# EAGLE design v11 (EAGLE 7.2.0)
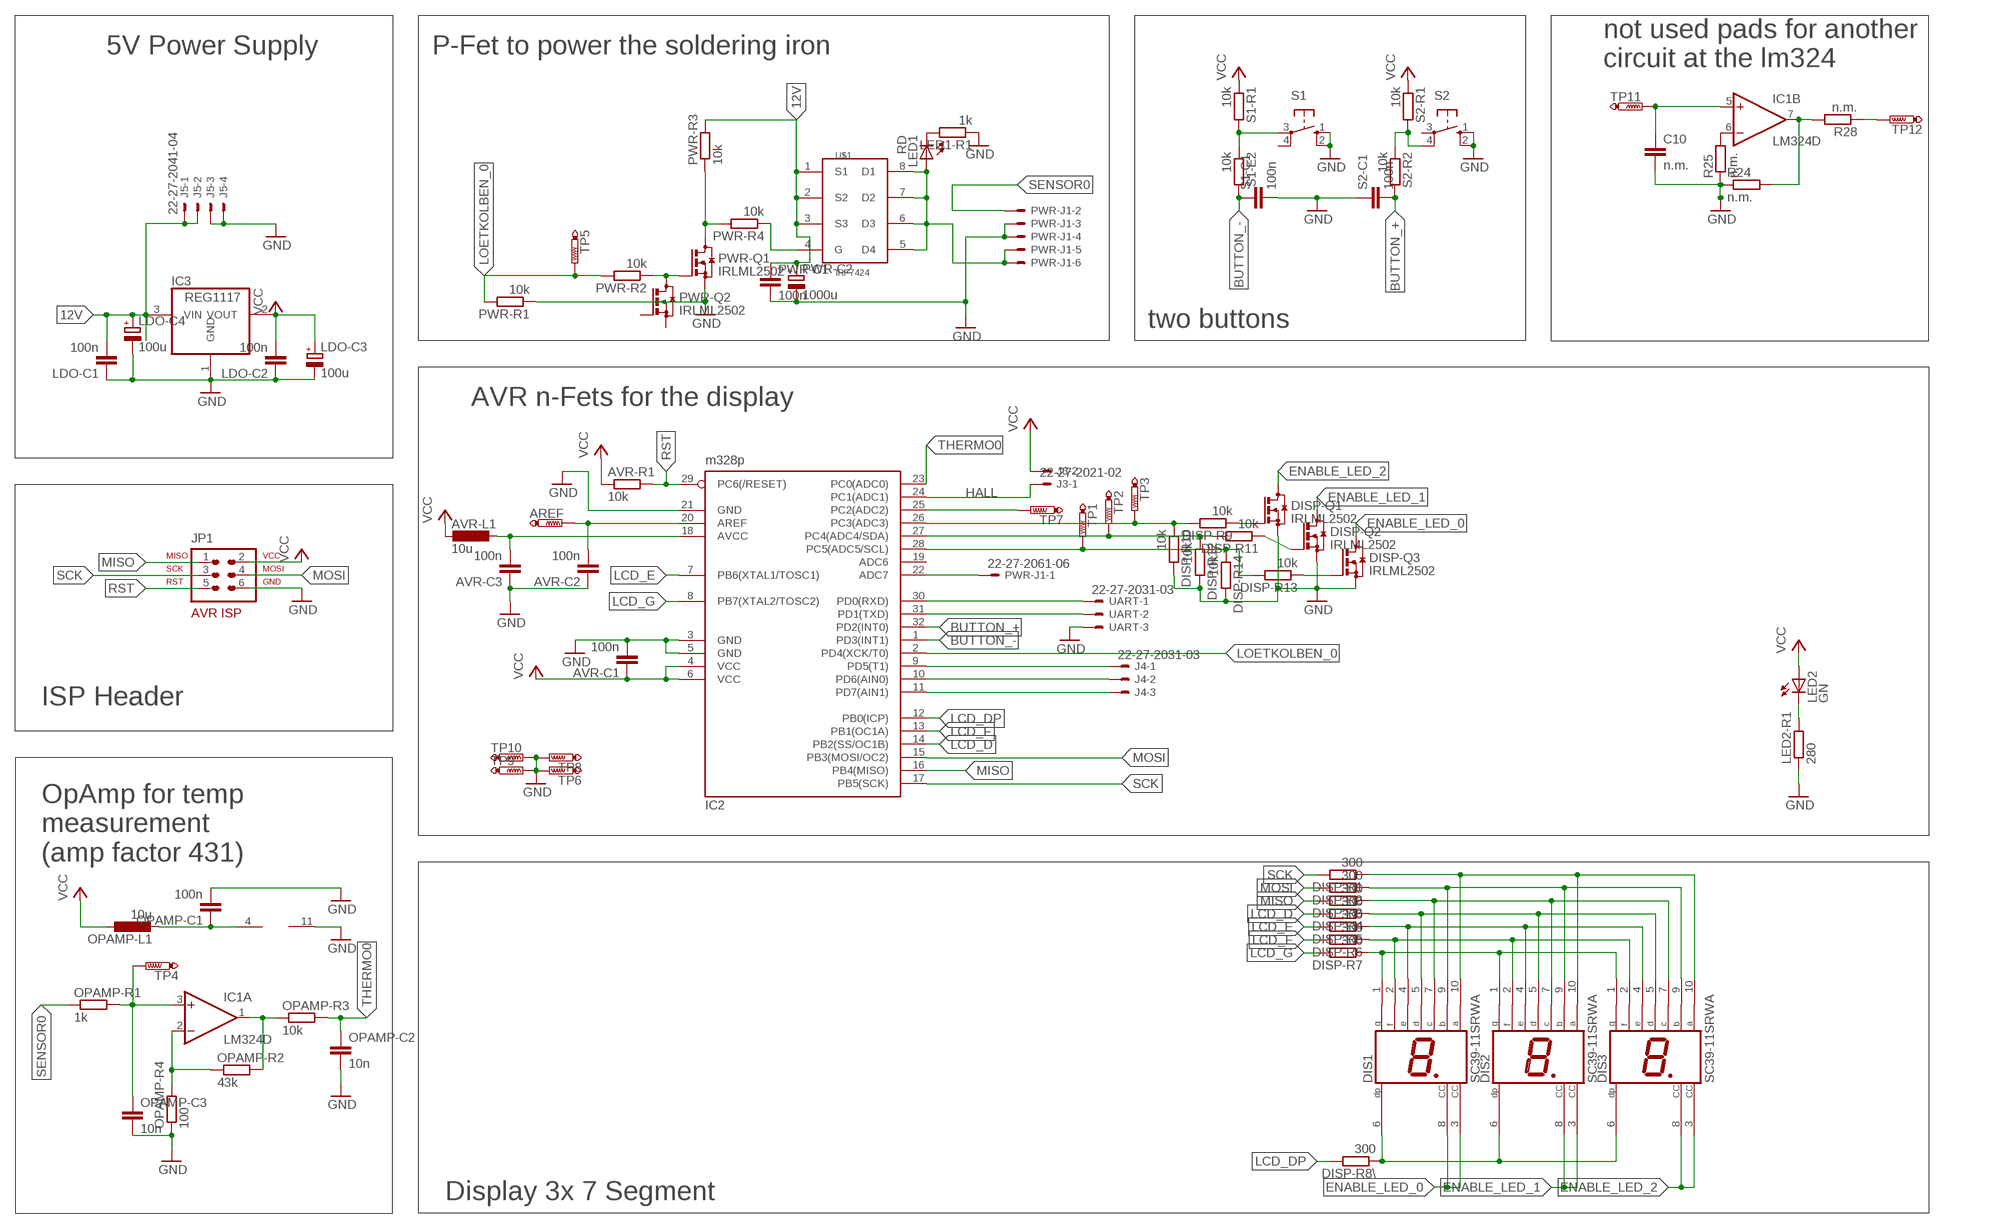
[diagram p0: schematic, sheet 1]

## Parts
AREF  PTR1B1,27  [B1,27]
AVR-C1  100n  C-EUC0603  [C0603]
AVR-C2  100n  C-EUC0603  [C0603]
AVR-C3  100n  C-EUC0603  [C0603]
AVR-L1  10u  L-EUL2825P  [L2825P]
AVR-R1  10k  R-EU_R0603  [R0603]
C10  n.m.  C-EUC0603  [C0603]
DIS1  SC39-11SRWA  [HDSP-E]
DIS2  SC39-11SRWA  [HDSP-E]
DIS3  SC39-11SRWA  [HDSP-E]
DISP-Q1  IRLML2502  BSS123  [SOT23]
DISP-Q2  IRLML2502  BSS123  [SOT23]
DISP-Q3  IRLML2502  BSS123  [SOT23]
DISP-R1  300  R-EU_R0603  [R0603]
DISP-R2  300  R-EU_R0603  [R0603]
DISP-R3  300  R-EU_R0603  [R0603]
DISP-R4  300  R-EU_R0603  [R0603]
DISP-R5  300  R-EU_R0603  [R0603]
DISP-R6  300  R-EU_R0603  [R0603]
DISP-R7  300  R-EU_R0603  [R0603]
DISP-R8\  300  R-EU_R0603  [R0603]
DISP-R9  10k  R-EU_R0603  [R0603]
DISP-R10  10k  R-EU_R0603  [R0603]
DISP-R11  10k  R-EU_R0603  [R0603]
DISP-R12  10k  R-EU_R0603  [R0603]
DISP-R13  10k  R-EU_R0603  [R0603]
DISP-R14  10k  R-EU_R0603  [R0603]
IC1  LM324D  [SO14]
IC2  m328p  MEGA8-AI  [TQFP32-08]
IC3  REG1117  [SOT223]
J3  22-27-2021-02  [6410-02]
J4  22-27-2031-03  [6410-03]
J5  22-27-2041-04  [6410-04]
JP1  AVR-ISP-6VERT  [AVR-ISP-6]
LDO-C1  100n  C-EUC0603  [C0603]
LDO-C2  100n  C-EUC0603  [C0603]
LDO-C3  100u  CPOL-EUE2-5  [E2-5]
LDO-C4  100u  CPOL-EUE2-5  [E2-5]
LED1  RD  LEDCHIP-LED0805  [CHIP-LED0805]
LED1-R1  1k  R-EU_R0603  [R0603]
LED2  GN  LEDCHIP-LED0805  [CHIP-LED0805]
LED2-R1  280  R-EU_R0603  [R0603]
OPAMP-C1  100n  C-EUC0603  [C0603]
OPAMP-C2  10n  C-EUC0603  [C0603]
OPAMP-C3  10n  C-EUC0603  [C0603]
OPAMP-L1  10u  L-EUL2825P  [L2825P]
OPAMP-R1  1k  R-EU_R0603  [R0603]
OPAMP-R2  43k  R-EU_R0603  [R0603]
OPAMP-R3  10k  R-EU_R0603  [R0603]
OPAMP-R4  100  R-EU_R0603  [R0603]
PWR-C1  100n  C-EUC0603  [C0603]
PWR-C2  1000u  CPOL-EUE5-13  [E5-13]
PWR-J1  22-27-2061-06  [6410-06]
PWR-Q1  IRLML2502  BSS123  [SOT23]
PWR-Q2  IRLML2502  BSS123  [SOT23]
PWR-R1  10k  R-EU_R0603  [R0603]
PWR-R2  10k  R-EU_R0603  [R0603]
PWR-R3  10k  R-EU_R0603  [R0603]
PWR-R4  10k  R-EU_R0603  [R0603]
R24  n.m.  R-EU_R0603  [R0603]
R25  n.m.  R-EU_R0603  [R0603]
R28  n.m.  R-EU_R0603  [R0603]
S1  10-XX  [B3F-10XX]
S1-C1  100n  C-EUC0603  [C0603]
S1-E2  10k  R-EU_R0603  [R0603]
S1-R1  10k  R-EU_R0603  [R0603]
S2  10-XX  [B3F-10XX]
S2-C1  100n  C-EUC0603  [C0603]
S2-R1  10k  R-EU_R0603  [R0603]
S2-R2  10k  R-EU_R0603  [R0603]
TP1  PTR1B1,27  [B1,27]
TP2  PTR1B1,27  [B1,27]
TP3  PTR1B1,27  [B1,27]
TP4  PTR1B1,27  [B1,27]
TP5  PTR1B1,27  [B1,27]
TP6  PTR1B1,27  [B1,27]
TP7  PTR1B1,27  [B1,27]
TP8  PTR1B1,27  [B1,27]
TP9  PTR1B1,27  [B1,27]
TP10  PTR1B1,27  [B1,27]
TP11  PTR1B1,27  [B1,27]
TP12  PTR1B1,27  [B1,27]
U$1  IRF7424  [SO-08]
UART  22-27-2031-03  [6410-03]

## Nets
12V: IC3.3(VIN) J5.1 J5.2 LDO-C1.2 LDO-C4.+ PWR-C1.1 PWR-C2.+ PWR-R3.2 U$1.1(S1) U$1.2(S2) U$1.3(S3)
ADC2: IC2.25(PC2(ADC2)) TP7.TP
ADC7: IC2.22(ADC7) PWR-J1.1
AREF: AREF.TP AVR-C2.2 IC2.20(AREF)
BUTTON_+: IC2.32(PD2(INT0)) S2-C1.2 S2-R2.2
BUTTON_-: IC2.1(PD3(INT1)) S1-C1.1 S1-E2.2
ENABLE_LED_0: DIS1.3(CC) DIS1.8(CC) DISP-Q3.3(D)
ENABLE_LED_1: DIS2.3(CC) DIS2.8(CC) DISP-Q2.3(D)
ENABLE_LED_2: DIS3.3(CC) DIS3.8(CC) DISP-Q1.3(D)
GND: AVR-C1.2 AVR-C2.1 AVR-C3.1 C10.2 DISP-Q1.2(S) DISP-Q2.2(S) DISP-Q3.2(S) DISP-R10.2 DISP-R12.2 DISP-R14.2 IC1.11(P:V-) IC2.3(GND) IC2.5(GND) IC2.21(GND) IC3.1(GND) J5.3 J5.4 JP1.6 LDO-C1.1 LDO-C2.1 LDO-C3.- LDO-C4.- LED1-R1.1 LED2-R1.1 OPAMP-C1.2 OPAMP-C2.2 OPAMP-C3.2 OPAMP-R4.1 PWR-C1.2 PWR-C2.- PWR-J1.3 PWR-J1.4 PWR-Q1.2(S) PWR-R1.1 R24.1 R25.1 S1-C1.2 S1.1(S) S1.2(S1) S2-C1.1 S2.1(S) S2.2(S1) TP6.TP TP8.TP TP9.TP TP10.TP UART.3
HALL: IC2.24(PC1(ADC1)) J3.1
LCD_D: DISP-R4.2 IC2.14(PB2(SS/OC1B))
LCD_DP: DISP-R8\.2 IC2.12(PB0(ICP))
LCD_E: DISP-R5.2 IC2.7(PB6(XTAL1/TOSC1))
LCD_F: DISP-R6.2 IC2.13(PB1(OC1A))
LCD_G: DISP-R7.2 IC2.8(PB7(XTAL2/TOSC2))
LOETKOLBEN_0: IC2.2(PD4(XCK/T0)) PWR-R1.2 PWR-R2.2 TP5.TP
MISO: DISP-R3.2 IC2.16(PB4(MISO)) JP1.1
MOSI: DISP-R2.2 IC2.15(PB3(MOSI/OC2)) JP1.4
N$1: IC1.2(A:-IN) OPAMP-R2.1 OPAMP-R4.2
N$2: DISP-R9.2 DISP-R10.1 IC2.26(PC3(ADC3)) TP3.TP
N$3: AVR-C3.2 AVR-L1.1 IC2.18(AVCC)
N$4: DISP-R13.2 DISP-R14.1 IC2.28(PC5(ADC5/SCL)) TP1.TP
N$5: IC1.4(P:V+) OPAMP-C1.1 OPAMP-L1.2
N$10: DISP-R11.2 DISP-R12.1 IC2.27(PC4(ADC4/SDA)) TP2.TP
N$15: PWR-R4.1 U$1.4(G)
N$16: PWR-Q1.1(G) PWR-Q2.3(D) PWR-R2.1
N$17: DISP-Q2.1(G) DISP-R11.1
N$18: DISP-Q1.1(G) DISP-R9.1
N$19: DISP-Q3.1(G) DISP-R13.1
N$20: IC1.6(B:-IN) R25.2
N$21: R28.1 TP12.TP
N$22: S1-E2.1 S1-R1.2 S1.3(P)
N$23: S2-R1.2 S2-R2.1 S2.4(P1)
N$24: LED2-R1.2 LED2.C
N$25: LED1-R1.2 LED1.C
N$26: IC1.7(B:OUT) R24.2 R28.2
N$27: IC1.3(A:+IN) OPAMP-C3.1 OPAMP-R1.2 TP4.TP
N$28: IC2.31(PD1(TXD)) UART.2
N$29: IC2.30(PD0(RXD)) UART.1
N$30: C10.1 IC1.5(B:+IN) TP11.TP
N$31: DIS1.6(DP) DIS2.6(DP) DIS3.6(DP) DISP-R8\.1
N$32: PWR-Q1.3(D) PWR-R3.1 PWR-R4.2
N$33: LED1.A PWR-J1.5 PWR-J1.6 U$1.5(D4) U$1.6(D3) U$1.7(D2) U$1.8(D1)
N$34: DIS1.2(F) DIS2.2(F) DIS3.2(F) DISP-R6.1
N$35: DIS1.1(G) DIS2.1(G) DIS3.1(G) DISP-R7.1
N$36: DIS1.4(E) DIS2.4(E) DIS3.4(E) DISP-R5.1
N$37: DIS1.5(D) DIS2.5(D) DIS3.5(D) DISP-R4.1
N$38: DIS1.7(C) DIS2.7(C) DIS3.7(C) DISP-R3.1
N$39: DIS1.9(B) DIS2.9(B) DIS3.9(B) DISP-R2.1
N$40: DIS1.10(A) DIS2.10(A) DIS3.10(A) DISP-R1.1
PD5: IC2.9(PD5(T1)) J4.1
PD6: IC2.10(PD6(AIN0)) J4.2
PD7: IC2.11(PD7(AIN1)) J4.3
RST: AVR-R1.2 IC2.29(PC6(/RESET)) JP1.5
SCK: DISP-R1.2 IC2.17(PB5(SCK)) JP1.3
SDFGHJK: IC1.1(A:OUT) OPAMP-R2.2 OPAMP-R3.1
SENSOR0: OPAMP-R1.1 PWR-J1.2
THERMO0: IC2.23(PC0(ADC0)) OPAMP-C2.1 OPAMP-R3.2
VCC: AVR-C1.1 AVR-L1.2 AVR-R1.1 IC2.4(VCC) IC2.6(VCC) IC3.2(VOUT) J3.2 JP1.2 LDO-C2.2 LDO-C3.+ LED2.A OPAMP-L1.1 S1-R1.1 S2-R1.1
Unconnected: IC1.8(C:OUT) IC1.9(C:-IN) IC1.10(C:+IN) IC1.12(D:+IN) IC1.13(D:-IN) IC1.14(D:OUT) IC2.19(ADC6) PWR-Q2.1(G) PWR-Q2.2(S) S1.4(P1) S2.3(P)

## Notes on the sheet
- 5V Power Supply | P-Fet to power the soldering iron
- not used pads for another
  circuit at the lm324
- two buttons
- AVR n-Fets for the display
- ISP Header
- OpAmp for temp
  measurement
  (amp factor 431)
- Display 3x 7 Segment

## Library data of the parts
AREF TP1-TP12 = testpad:PTR1: TEST PIN
AVR-C1-AVR-C3 C10 LDO-C1 LDO-C2 OPAMP-C1-OPAMP-C3 PWR-C1 S1-C1 S2-C1 = rcl:C-EU: CAPACITOR, European symbol
AVR-L1 OPAMP-L1 = rcl:L-EU: INDUCTOR, European symbol
AVR-R1 DISP-R1-DISP-R7 DISP-R8\ DISP-R9-DISP-R14 LED1-R1 LED2-R1 OPAMP-R1-OPAMP-R4 PWR-R1-PWR-R4 R24 R25 R28 S1-E2 S1-R1 S2-R1 S2-R2 = rcl:R-EU_: RESISTOR, European symbol
DIS1-DIS3 = display-hp:SC39-11SRWA: SINGLE DIGIT NUMERIC DISPLAY 9.9mm (0.39INCH) Source: SC39-11SRWA.pdf; OC_FARNELL: unknown; OC_NEWARK: unknown
DISP-Q1-DISP-Q3 PWR-Q1 PWR-Q2 = transistor-small-signal:BSS123: N-CHANNEL MOS FET
IC1 = linear:LM324: OP AMP
IC2 = atmel:MEGA8: MICROCONTROLLER 8 Kbytes FLASH, 1 kbytes SRAM, 512 bytes EEPROM, USART, 6-channel 10 bit ADC, 2-channel 8 bit ADC Pin compatible with Atmega48, ATMega88, ATMega168 Source: avr.lbr; MPN: ATMEGA8-16AU; OC_FARNELL: 9171371; OC_NEWARK: 73M8863
IC3 = burr-brown:REG1117: 800mA and 1A Low Dropout (LDO) Positive Regulator 1.8V, 2.5V, 2.85V, 3.3V, 5V, and Adj; MPN: REG1117; OC_FARNELL: 1097566; OC_NEWARK: 14P6981
J3 = con-molex:22-?-02: CONNECTOR wire to board 2.54 mm (.1 inch) pitch header; OC_FARNELL: unknown; OC_NEWARK: unknown
J4 UART = con-molex:22-?-03: CONNECTOR wire to board 2.54 mm (.1 inch) pitch header; OC_FARNELL: unknown; OC_NEWARK: unknown
J5 = con-molex:22-?-04: CONNECTOR wire to board 2.54 mm (.1 inch) pitch header; OC_FARNELL: unknown; OC_NEWARK: unknown
JP1 = avr-7:AVR-ISP-6: AVR ISP-6 Serial Programming Header
LDO-C3 LDO-C4 PWR-C2 = rcl:CPOL-EU: POLARIZED CAPACITOR, European symbol
LED1 LED2 = led:LED: LED OSRAM: - CHIPLED LG R971, LG N971, LY N971, LG Q971, LY Q971, LO R971, LY R971 LH N974, LH R974 LS Q976, LO Q976, LY Q976 LO Q996 - Hyper CHIPLED LW Q18S LB Q993, LB Q99A, LB R99A - SideLED LS A670, LO A670, LY A670, LG A670, LP A670 LB A673, LV A673, LT A673, LW A673 LH A674 LY A675 LS A676, LA A676, LO A676, LY A676, LW A676 LS A679, LY A679, LG A679 - Hyper Micro SIDELED® LS Y876, LA Y876, LO Y876, LY Y876 LT Y87S - SmartLED LW L88C, LW L88S LB L89C, LB L89S, LG L890 LS L89K, LO L89K, LY L89K LS L896, LA L896, LO L896, LY L896 - TOPLED LS T670, LO T670, LY T670, LG T670, LP T670 LSG T670, LSP T670, LSY T670, LOP T670, LYG T670 LG T671, LOG T671, LSG T671 LB T673, LV T673, LT T673, LW T673 LH T674 LS T676, LA T676, LO T676, LY T676, LB T676, LH T676, LSB T676, LW T676 LB T67C, LV T67C, LT T67C, LS T67K, LO T67K, LY T67K, LW E67C LS E67B, LA E67B, LO E67B, LY E67B, LB E67C, LV E67C, LT E67C LW T67C LS T679, LY T679, LG T679 LS T770, LO T770, LY T770, LG T770, LP T770 LB T773, LV T773, LT T773, LW T773 LH T774 LS E675, LA E675, LY E675, LS T675 LS T776, LA T776, LO T776, LY T776, LB T776 LHGB T686 LT T68C, LB T68C - Hyper Mini TOPLED® LB M676 - Mini TOPLED Santana® LG M470 LS M47K, LO M47K, LY M47K Source: http://www.osram.convergy.de LUXEON: - LUMILED® LXK2-PW12-R00, LXK2-PW12-S00, LXK2-PW14-U00, LXK2-PW14-V00 LXK2-PM12-R00, LXK2-PM12-S00, LXK2-PM14-U00 LXK2-PE12-Q00, LXK2-PE12-R00, LXK2-PE12-S00, LXK2-PE14-T00, LXK2-PE14-U00 LXK2-PB12-K00, LXK2-PB12-L00, LXK2-PB12-M00, LXK2-PB14-N00, LXK2-PB14-P00, LXK2-PB14-Q00 LXK2-PR12-L00, LXK2-PR12-M00, LXK2-PR14-Q00, LXK2-PR14-R00 LXK2-PD12-Q00, LXK2-PD12-R00, LXK2-PD12-S00 LXK2-PH12-R00, LXK2-PH12-S00 LXK2-PL12-P00, LXK2-PL12-Q00, LXK2-PL12-R00 Source: www.luxeon.com KINGBRIGHT: KA-3528ASYC Source: www.kingbright.com
PWR-J1 = con-molex:22-?-06: CONNECTOR wire to board 2.54 mm (.1 inch) pitch header; OC_FARNELL: unknown; OC_NEWARK: unknown
S1 S2 = switch-omron:10-XX: OMRON SWITCH; MPN: B3F-1000; OC_FARNELL: 176432; OC_NEWARK: 36M3542
U$1 = MyLib:IRF7424

## Board
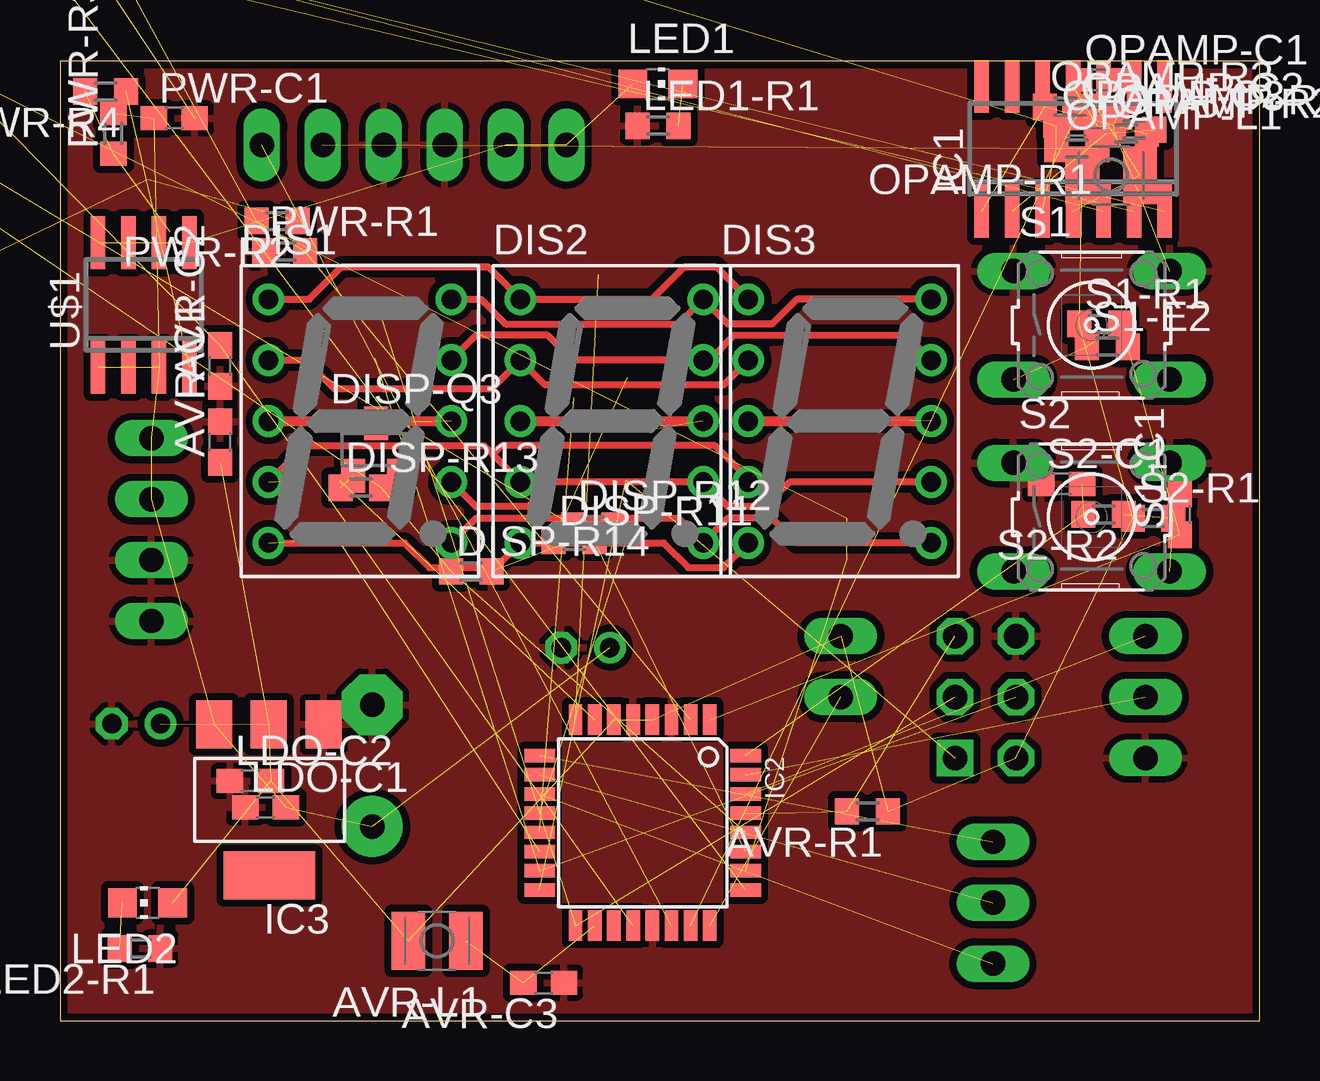
[diagram p1: board, top side]
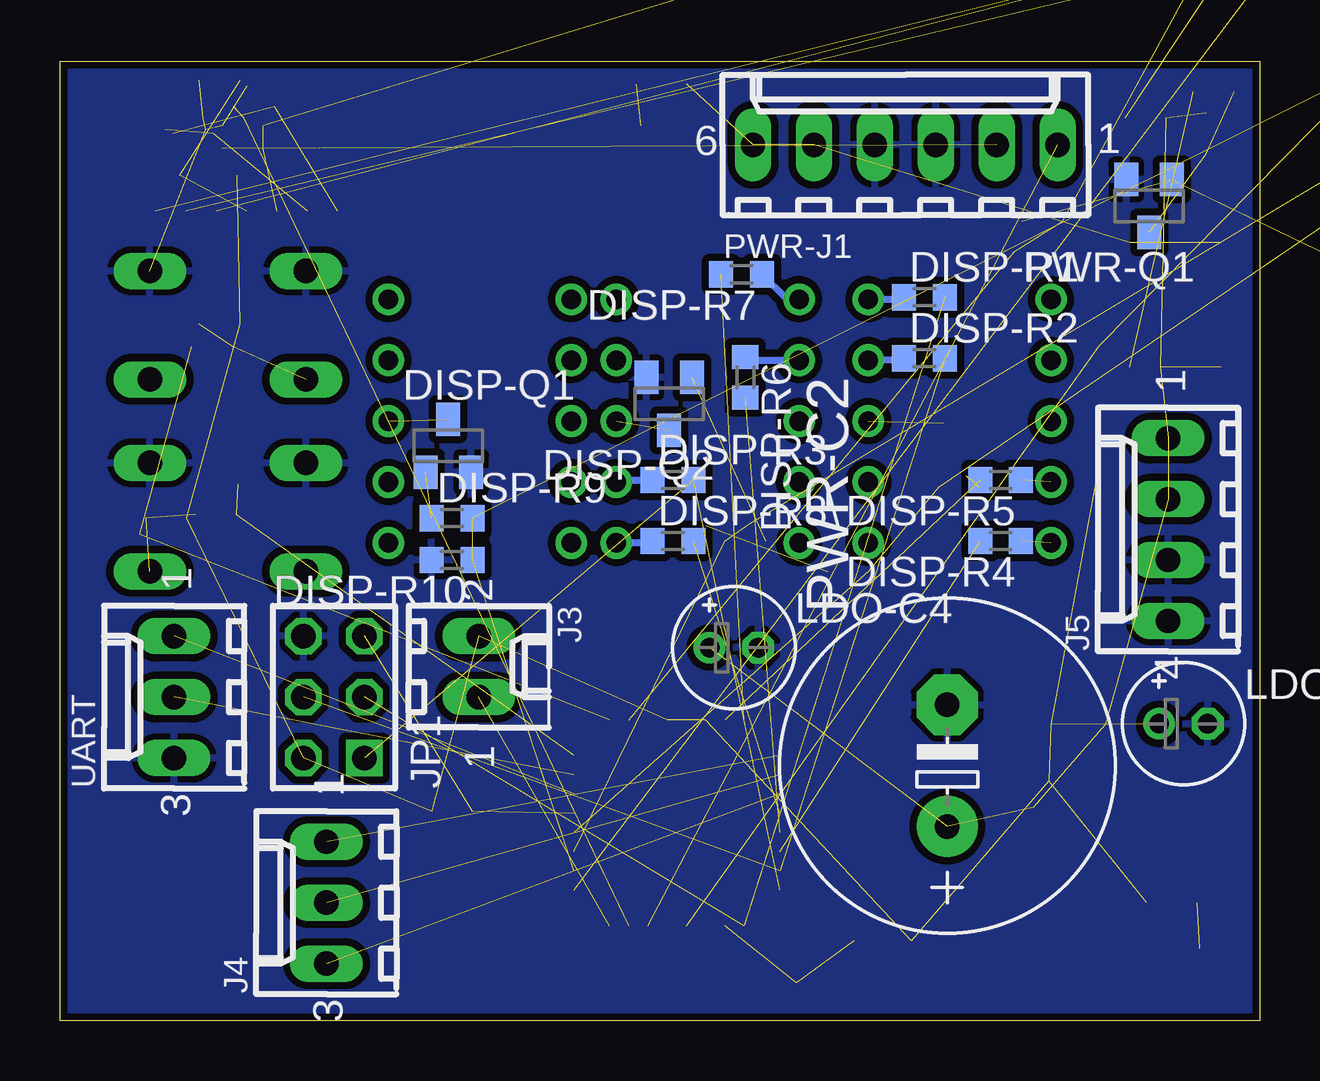
[diagram p2: board, bottom side, seen from below]

Size 50 x 40 mm. Coordinates in mm from the lower left corner, seen from the top.
Outline: 0,0 50,0 50,40 0,40 0,0
Copper layers (1*16): Top 0.035mm / dielectric 1.5mm / Bottom 0.035mm
Design rules "ITEADstudio_DRC": minimum track width 6mil, minimum drill 12mil, track to track 6mil, track to pad 6mil, pad to pad 6mil, via to via 6mil, smd to smd 0mil, copper to edge 10mil, drill to drill 10mil, minimum pad ring 10mil, minimum via ring 6mil, stop-mask expansion 2mil, vias tented up to drill 100mil, thermal gap 10mil

### Footprints (pad centres in the part's own frame; a part is rotated, then mirrored left to right if it is on the bottom)
B1,27 = smd 1.27 x 1.27: TP 0,0
C0603 = smd 1.1 x 1: 1 -0.85,0; 2 0.85,0
L2825P = smd 1.4 x 2.4: 1 -1.2,0; 2 1.2,0
R0603 = smd 1 x 1.1: 1 -0.85,0; 2 0.85,0
HDSP-E = drill 0.813: 1 -3.81,5.08; 2 -3.81,2.54; 3 -3.81,0; 4 -3.81,-2.54; 5 -3.81,-5.08; 6 3.81,-5.08; 7 3.81,-2.54; 8 3.81,0; 9 3.81,2.54; 10 3.81,5.08
SOT23 = smd 1 x 1.4: 1 -0.95,-1.1; 2 0.95,-1.1; 3 0,1.1
SO14 = smd 0.6 x 2.2: 1 -3.81,-2.6; 2 -2.54,-2.6; 3 -1.27,-2.6; 4 0,-2.6; 5 1.27,-2.6; 6 2.54,-2.6; 7 3.81,-2.6; 8 3.81,2.6; 9 2.54,2.6; 10 1.27,2.6; 11 0,2.6; 12 -1.27,2.6; 13 -2.54,2.6; 14 -3.81,2.6
TQFP32-08 = smd 1.27 x 0.559: 1 -4.293,2.8; 2 -4.293,2; 3 -4.293,1.2; 4 -4.293,0.4; 5 -4.293,-0.4; 6 -4.293,-1.2; 7 -4.293,-2; 8 -4.293,-2.8; 17 4.293,-2.8; 18 4.293,-2; 19 4.293,-1.2; 20 4.293,-0.4; 21 4.293,0.4; 22 4.293,1.2; 23 4.293,2; 24 4.293,2.8 | smd 0.559 x 1.27: 9 -2.8,-4.293; 10 -2,-4.293; 11 -1.2,-4.293; 12 -0.4,-4.293; 13 0.4,-4.293; 14 1.2,-4.293; 15 2,-4.293; 16 2.8,-4.293; 25 2.8,4.293; 26 2,4.293; 27 1.2,4.293; 28 0.4,4.293; 29 -0.4,4.293; 30 -1.2,4.293; 31 -2,4.293; 32 -2.8,4.293
SOT223 = smd 1.499 x 2.007: 1 -2.261,-3.15; 2 0.025,-3.15; 3 2.311,-3.15 | smd 3.81 x 2.007: 4 0,3.15
6410-02 = drill 1.016 long: 1 1.27,0; 2 -1.27,0
6410-03 = drill 1.016 long: 1 2.54,0; 2 0,0; 3 -2.54,0
6410-04 = drill 1.016 long: 1 3.81,0; 2 1.27,0; 3 -1.27,0; 4 -3.81,0
AVR-ISP-6 = drill 1.016 square: 1 -2.54,-1.27 | drill 1.016 octagon: 2 -2.54,1.27; 3 0,-1.27; 4 0,1.27; 5 2.54,-1.27; 6 2.54,1.27
E2-5 = drill 0.813 pad 1.27: + -1.016,0 | drill 0.813 pad 1.27 octagon: - 1.016,0
CHIP-LED0805 = smd 1.2 x 1.2: A 0,-1.05; C 0,1.05
E5-13 = drill 1.016 pad 2.54: + -2.54,0 | drill 1.016 pad 2.54 octagon: - 2.54,0
6410-06 = drill 1.016 long: 1 6.35,0; 2 3.81,0; 3 1.27,0; 4 -1.27,0; 5 -3.81,0; 6 -6.35,0
B3F-10XX = drill 1.016 long: 1 -3.251,2.261; 2 3.251,2.261; 3 -3.251,-2.261; 4 3.251,-2.261
SO-08 = smd 0.6 x 2.2: 1 -1.905,-2.6; 2 -0.635,-2.6; 3 0.635,-2.6; 4 1.905,-2.6; 5 1.905,2.6; 6 0.635,2.6; 7 -0.635,2.6; 8 -1.905,2.6

### Placement (x,y rotation side)
AREF  -38.1,73.66 0 top  (outside the outline)
AVR-C1  6.67,24.13 90 top
AVR-C2  6.67,27.3 90 top
AVR-C3  20.16,1.59 180 top
AVR-L1  15.72,3.33 180 top
AVR-R1  33.66,8.73 180 top
C10  -54.61,59.69 0 top  (outside the outline)
DIS1  12.5,25 0 top
DIS2  23,25 0 top
DIS3  32.5,25 0 top
DISP-Q1  33.81,23.97 0 bottom
DISP-Q2  24.61,25.72 180 bottom
DISP-Q3  13.18,23.81 0 top
DISP-R1  13.97,30.16 0 bottom
DISP-R2  13.97,27.62 0 bottom
DISP-R3  24.45,22.54 0 bottom
DISP-R4  10.79,20 180 bottom
DISP-R5  10.79,22.54 180 bottom
DISP-R6  21.43,26.83 270 bottom
DISP-R7  21.59,31.11 180 bottom
DISP-R8\  24.45,20 0 bottom
DISP-R9  33.66,20.95 0 bottom
DISP-R10  33.66,19.21 180 bottom
DISP-R11  21.43,20 0 top
DISP-R12  22.23,20.64 0 top
DISP-R13  12.54,22.23 0 top
DISP-R14  17.14,18.73 0 top
IC1  42.23,36.35 0 top
IC2  24.29,8.26 270 top
IC3  8.73,9.21 180 top
J3  32.54,14.76 270 bottom
J4  38.89,4.92 90 bottom
J5  3.81,20.48 90 bottom
JP1  38.58,13.49 90 bottom
LDO-C1  8.57,8.89 0 top
LDO-C2  7.94,10 0 top
LDO-C3  3.17,12.38 0 bottom
LDO-C4  21.91,15.56 0 bottom
LED1  24.92,39.05 270 top
LED1-R1  24.92,37.31 0 top
LED2  3.65,4.92 90 top
LED2-R1  3.33,3.02 180 top
OPAMP-C1  43.34,39.21 0 top
OPAMP-C2  43.18,37.62 0 top
OPAMP-C3  42.39,37.31 0 top
OPAMP-L1  43.81,35.24 0 top
OPAMP-R1  42.39,36.35 180 top
OPAMP-R2  44.45,36.99 0 top
OPAMP-R3  41.91,38.1 0 top
OPAMP-R4  44.77,37.15 0 top
PWR-C1  4.76,37.62 0 top
PWR-C2  13.02,10.64 90 bottom
PWR-J1  14.76,36.51 0 bottom
PWR-Q1  4.6,33.97 180 bottom
PWR-Q2  -76.2,-4.45 0 top  (outside the outline)
PWR-R1  9.37,32.07 0 top
PWR-R2  9.05,33.34 180 top
PWR-R3  2.22,36.99 90 top
PWR-R4  1.91,38.73 180 top
R24  -59.69,59.69 0 top  (outside the outline)
R25  -64.77,59.69 0 top  (outside the outline)
R28  -69.85,59.69 0 top  (outside the outline)
S1  43,29 0 top
S1-C1  46.67,21.11 90 top
S1-E2  43.66,28.1 0 top
S1-R1  43.34,29.05 0 top
S2  43,21 0 top
S2-C1  41.75,22.38 0 top
S2-R1  45.56,20.95 0 top
S2-R2  43.5,21.11 180 top
TP1  -62.23,73.66 0 top  (outside the outline)
TP2  -67.31,73.66 0 top  (outside the outline)
TP3  -72.39,73.66 0 top  (outside the outline)
TP4  -77.47,73.66 0 top  (outside the outline)
TP5  -16.51,78.74 0 top  (outside the outline)
TP6  -21.59,78.74 0 top  (outside the outline)
TP7  -26.67,78.74 0 top  (outside the outline)
TP8  -31.75,78.74 0 top  (outside the outline)
TP9  -36.83,78.74 0 top  (outside the outline)
TP10  -44.45,73.66 0 top  (outside the outline)
TP11  -50.8,73.66 0 top  (outside the outline)
TP12  -57.15,73.66 0 top  (outside the outline)
U$1  3.49,29.84 0 top
UART  45.24,13.49 90 bottom

### Tracks (layer width: path | path; a pad name or v marks a point on that pad's centre or on a via)
12V  (10 unrouted)
ADC2  (1 unrouted)
ADC7  (1 unrouted)
AREF  (2 unrouted)
BUTTON_+  (2 unrouted)
BUTTON_-  (2 unrouted)
ENABLE_LED_0  (1 unrouted)
  Top 0.406: DIS1.3 DIS1.8
ENABLE_LED_1  (1 unrouted)
  Top 0.406: DIS2.3 DIS2.8
ENABLE_LED_2  (1 unrouted)
  Top 0.406: DIS3.3 DIS3.8
GND  (13 unrouted)
  pour Top (isolate 0.3): 0,40.01 50.01,40.01 50.01,0 0,0
  pour Bottom (isolate 0.3): 0,40.01 50.01,40.01 50.01,0 0,0
HALL  (1 unrouted)
LCD_D  (1 unrouted)
LCD_DP  (1 unrouted)
LCD_E  (1 unrouted)
LCD_F  (1 unrouted)
LCD_G  (1 unrouted)
LOETKOLBEN_0  (3 unrouted)
MISO  (2 unrouted)
MOSI  (2 unrouted)
N$1  (2 unrouted)
N$2  (3 unrouted)
N$3  (2 unrouted)
N$4  (3 unrouted)
N$5  (2 unrouted)
N$10  (3 unrouted)
N$15  (1 unrouted)
N$16  (2 unrouted)
N$17  (1 unrouted)
N$18  (1 unrouted)
N$19  (1 unrouted)
N$20  (1 unrouted)
N$21  (1 unrouted)
N$22  (2 unrouted)
N$23  (2 unrouted)
N$24  (1 unrouted)
N$25  (1 unrouted)
N$26  (2 unrouted)
N$27  (3 unrouted)
N$28  (1 unrouted)
N$29  (1 unrouted)
N$30  (2 unrouted)
N$31
  Top 0.3: DIS3.6 30.72,19.92 29.69,20.95 27.84,20.95 DIS2.6 25.77,20.95 17.34,20.95 DIS1.6
  Bottom 0.3: DISP-R8\.1 25.38,19.92 DIS2.6
N$32  (2 unrouted)
N$33  (6 unrouted)
N$34
  Top 0.3: DIS1.2 10.24,27.54 11.43,26.35 18,26.35 DIS2.2 20.22,26.51 27.66,26.51 DIS3.2
  Bottom 0.3: DISP-R6.1 21.29,27.54 DIS2.2
N$35
  Top 0.3: DIS1.1 10.39,30.08 11.75,31.43 17.84,31.43 DIS2.1 24.68,30.08 26.04,31.43 27.34,31.43 DIS3.1
  Bottom 0.3: DIS2.1 19.7,30.08 DISP-R7.1
N$36  (1 unrouted)
  Top 0.3: DIS1.4 10.2,23.97 17.68,23.97 18.05,23.6 | 18.05,23.6 DIS2.4 | DIS3.4 28.69,22.59 27.3,23.97 18.41,23.97 18.05,23.6
N$37  (1 unrouted)
  Top 0.3: DIS3.5 27.66,18.89 26.19,18.89 25.16,19.92 DIS2.5 18.16,18.89 15.4,18.89 14.37,19.92 DIS1.5
N$38
  Top 0.3: DIS1.7 17.34,21.43 19.53,21.43 20.55,22.46 DIS2.7 27.84,21.43 29.37,21.43 30.4,22.46 DIS3.7
  Bottom 0.3: DIS2.7 26.73,22.54 DISP-R3.1
N$39
  Top 0.3: DIS1.9 17.34,28.57 20.32,28.57 21.36,27.54 DIS2.9 27.06,27.54 28.1,28.57 35.27,28.57 DIS3.9
  Bottom 0.3: DISP-R2.1 14.9,27.54 DIS1.9
N$40
  Top 0.3: DIS1.10 17.55,30.08 18.57,29.05 25.78,29.05 DIS2.10 27.84,29.05 29.69,29.05 30.71,30.08 DIS3.10
  Bottom 0.3: DIS1.10 14.9,30.08
  Bottom 0.406: 14.9,30.08 DISP-R1.1
PD5  (1 unrouted)
PD6  (1 unrouted)
PD7  (1 unrouted)
RST  (2 unrouted)
SCK  (2 unrouted)
SDFGHJK  (2 unrouted)
SENSOR0  (1 unrouted)
THERMO0  (2 unrouted)
VCC  (13 unrouted)